# EasyEDA schematic TOUG.json
TITLE: Sheet_1; REV: 1.0; Date: 2024-01-13; Sheet: 1/1; Drawn By: djtef; Company: Your Company
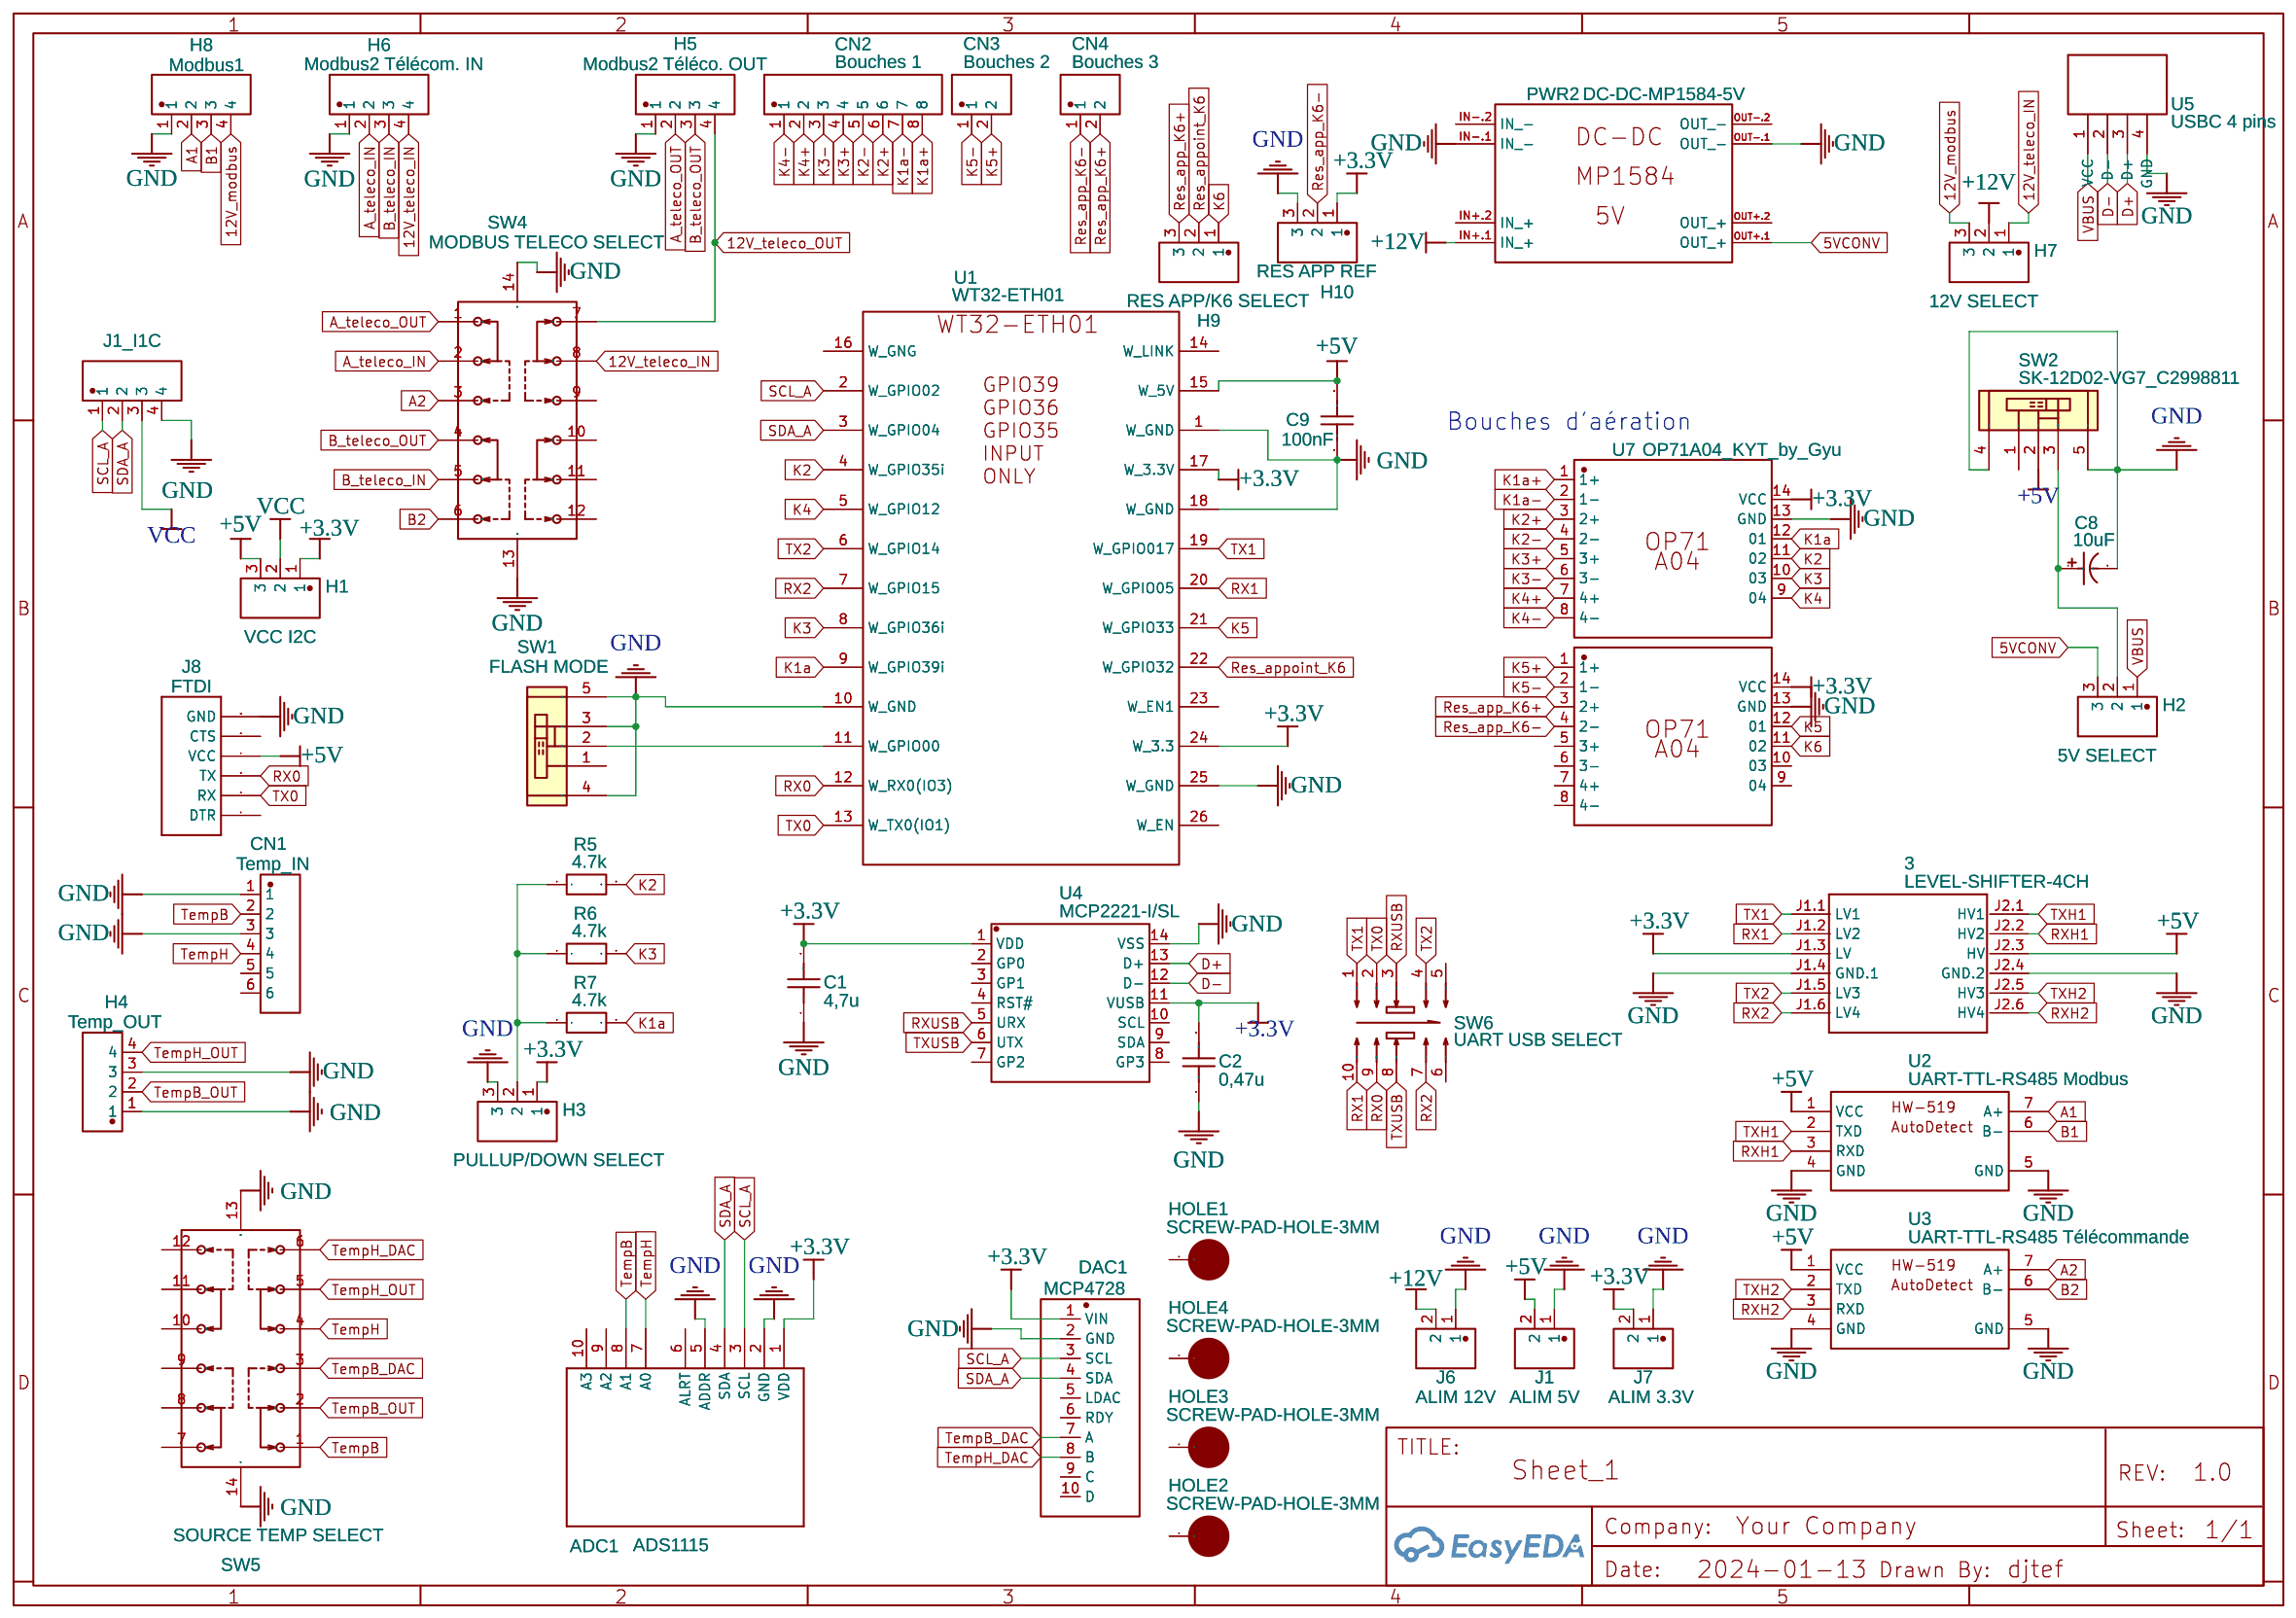
[diagram p0: schematic sheet]

## Parts
3  LEVEL-SHIFTER-4CH  [LEVEL-SHIFTER-4CH]
ADC1  ADS1115  [ADC-4CH-ADS1115]
C1  4,7u  [RAD-0.1]
C2  0,47u  [RAD-0.1]
C8  10uF  [CAP-TH_BD5.0-P2.00-D0.8-FD]
C9  100nF  [CAP-TH_L7.2-W2.5-P5.00-D0.5]
CN1  Temp_IN  [CONN-TH_5P-P2.50_S06B-XASK-1-LF-SN]
CN2  Bouches 1  [CONN-TH_8P-P2.54_KF2EDGR-2.54-8P]
CN3  Bouches 2  [CONN-TH_P2.54_KF2EDGR-2.54-2P]
CN4  Bouches 3  [CONN-TH_P2.54_KF2EDGR-2.54-2P]
DAC1  MCP4728  [MCP4728]
H1  VCC I2C  [HDR-TH_3P-P2.54-V-M]
H2  5V SELECT  [HDR-TH_3P-P2.54-V-M]
H3  PULLUP/DOWN SELECT  [HDR-TH_3P-P2.54-V-M]
H4  Temp_OUT  [HDR-TH_4P-P2.50-V-F-1]
H5  Modbus2 Téléco. OUT  [CONN-TH_S04B-XASK-1-LF-SN]
H6  Modbus2 Télécom. IN  [HDR-TH_4P-P2.50-V-F-1]
H7  12V SELECT  [HDR-TH_3P-P2.54-V-M]
H8  Modbus1  [HDR-TH_4P-P2.50-V-F-1]
H9  RES APP/K6 SELECT  [HDR-TH_3P-P2.54-V-M]
H10  RES APP REF  [HDR-TH_3P-P2.54-V-M]
HOLE1  SCREW-PAD-HOLE-3MM  [PKG-SCREW-MOUNTING-HOLE-3MM]
HOLE2  SCREW-PAD-HOLE-3MM  [PKG-SCREW-MOUNTING-HOLE-3MM]
HOLE3  SCREW-PAD-HOLE-3MM  [PKG-SCREW-MOUNTING-HOLE-3MM]
HOLE4  SCREW-PAD-HOLE-3MM  [PKG-SCREW-MOUNTING-HOLE-3MM]
J1  ALIM 5V  [CONN-TH_2P-P5.08_KF2EDGR-5.08-2P]
J1_I1C  I2C  [HDR-TH_4P-P2.50-V-F-1]
J6  ALIM 12V  [CONN-TH_P5.00_KF301-5.0-2P]
J7  ALIM 3.3V  [CONN-TH_2P-P5.08_KF2EDGR-5.08-2P]
J8  FTDI  [FTDI]
PWR2  DC-DC-MP1584-5V  [DC-DC-STEP-DOWN-MP1584]
R5  4.7k  [RES-TH_BD2.7-L6.2-P10.20-D0.4]
R6  4.7k  [RES-TH_BD2.7-L6.2-P10.20-D0.4]
R7  4.7k  [RES-TH_BD2.7-L6.2-P10.20-D0.4]
SW1  FLASH MODE  [SW-TH_DEALON_SK-12D02-VG7]
SW2  SK-12D02-VG7_C2998811  [SW-TH_DEALON_SK-12D02-VG7]
SW4  MODBUS TELECO SELECT  [SW-TH_KH-SS42D02-G3]
SW5  SOURCE TEMP SELECT  [SW-TH_KH-SS42D02-G3]
SW6  UART USB SELECT  [SW-TH_10P-L29.8-W9.2-P4.00_SS-24H03-G070]
U1  WT32-ETH01  [WT32-ETH01]
U2  UART-TTL-RS485 Modbus  [UART-TTL-RS485. V2]
U3  UART-TTL-RS485 Télécommande  [UART-TTL-RS485. V2]
U4  MCP2221-I/SL  [SOIC-14_L8.7-W3.9-P1.27-LS6.0-BL]
U5  USBC 4 pins  [USB_C 4 PIN]
U7  OP71A04_KYT_by_Gyu  [OP71]
U14  OP71A04_KYT_by_Gyu  [OP71]

## Library data of the parts
3 = LEVEL-SHIFTER-4CH: Contributor: vivianmascarinhas
ADC1 = ADC-4CH-ADS1115: Contributor: David de la Torre
C1 C2 = C_RAD-0.1_US: Contributor: LCEDA_Lib
C8 = electrolytic capacitor 10UF 50V high frequency: Supplier: LCSC; Manufacturer: CX(承兴); Manufacturer Part: GR106M050D11RR0VK2FP0; Supplier Part: C78759; JLCPCB Part Class: Extended Part
C9 = PE104J2A0501: Contributor: LCSC; Supplier: LCSC; Supplier Part: C390170; Manufacturer: KYET(科雅); JLCPCB Part Class: Extended Part
CN1 = S06B-XASK-1(LF)(SN): Contributor: LCSC; Supplier: LCSC; Supplier Part: C263755; Manufacturer: JST; JLCPCB Part Class: Extended Part
CN2 = KF2EDGR-2.54-8P: Contributor: LCSC; Supplier: LCSC; Supplier Part: C577600; Manufacturer: KEFA(科发); JLCPCB Part Class: Extended Part
CN3 CN4 = KF2EDGR-2.54-2P: Contributor: LCSC; Supplier: LCSC; Supplier Part: C577594; Manufacturer: KEFA(科发); JLCPCB Part Class: Extended Part
DAC1 = GY-MCP4728: Manufacturer: Aliexpress; Supplier: Aliexpress; link: https://www.aliexpress.com/item/1005003649040920.html?spm=a2g0o.order_list.0.0.4ef63696hAxzZi&gatewayAdapt=glo2ita; Contributor: Kristoffer Olström
H1-H3 H7 H9 H10 = DZ254R-11-03-63: Contributor: LCSC; Supplier: LCSC; Supplier Part: C2935909; Manufacturer: DEALON(德艺隆); JLCPCB Part Class: Extended Part
H4 H6 H8 J1_I1C = XH-2.54-4P: Contributor: LCSC; Supplier: LCSC; Supplier Part: C18185674; Manufacturer: SHOU HAN(首韩); Manufacturer Part: 2.54-4P WZDK; JLCPCB Part Class: Extended Part
H5 = XH-2.54-4P: Contributor: LCSC; Supplier: LCSC; Supplier Part: C22382738; Manufacturer: DLL; Manufacturer Part: DL25018-4AWD-S; JLCPCB Part Class: Extended Part
HOLE1-HOLE4 = SCREW-PAD-HOLE-3MM: THT 3MM SCREW MOUNTING HOLE; Contributor: Prof. Ing. F. Scordino
J1 J7 = KF2EDGR-5.08-2P: Contributor: LCSC; Supplier: LCSC; Supplier Part: C441204; Manufacturer: KEFA(科发); JLCPCB Part Class: Extended Part
J6 = KF301-5.0-2P: Contributor: LCSC; Supplier: LCSC; Supplier Part: C474881; Manufacturer: KEFA(科发); JLCPCB Part Class: Extended Part
J8 = FTDI HEADERX6: Contributor: cpu76239
PWR2 = DC-DC-MP1584-5V: Contributor: karel.slavicek
R5-R7 = R_AXIAL-1.0_EU: Supplier Part: C2896834; Supplier: LCSC; Contributor: LCEDA_Lib; Manufacturer Part: CR1/4W-4K7±5%-ST52; Manufacturer: VO(翔胜)
SW1 SW2 = SK-12D02-VG7_C2998811: Contributor: lcsc; Supplier: LCSC; Supplier Part: C2998811; Manufacturer: DEALON(德艺隆); Manufacturer Part: SK-12D02-VG7; JLCPCB Part Class: Extended Part; link: https://lcsc.com/eda_search?q=C2998811&%26type=1&ref=editor
SW4 SW5 = KH-SS42D02-G3: Contributor: lcsc; Supplier: LCSC; Supplier Part: C5274503; Manufacturer: kinghelm(金航标); JLCPCB Part Class: Extended Part
SW6 = SS-24H03-G070: Contributor: LCSC; Supplier: LCSC; Supplier Part: C2876019; Manufacturer: G-Switch(品赞); JLCPCB Part Class: Extended Part
U1 = WT32-ETH01: Manufacturer: Wireless-Tag; link: http://www.wireless-tag.com/wp-content/uploads/2020/08/WT32-ETH01规格书V1.2EN（英文）.pdf; Contributor: chicoDaMan
U2 U3 = UART-TTL-RS485_HW-519: Contributor: Compesalogger
U4 = MCP2221-I/SL: Contributor: LCSC; Supplier: LCSC; Supplier Part: C184842; Manufacturer: MICROCHIP(美国微芯); JLCPCB Part Class: Extended Part
U5 = USBC 4 pins: Contributor: javier97sm
U7 U14 = OP71A04_KYT_by_Gyu: Supplier: Ali; Contributor: jirwald

## Nets
5VCONV: H2.3 PWR2.OUT+.1(OUT +)
12V_modbus: H7.3 H8.4
12V_teleco_IN: H6.4 H7.1 SW4.8
12V_teleco_OUT: H5.4 SW4.7
+3.3V: 3.J1.3(LV) ADC1.1(VDD) C1.2 C2.2 DAC1.1(VIN) H1.1 H3.1 H10.1 J7.2 U1.17(W_3.3V) U1.24(W_3.3) U4.1(VDD) U4.11(VUSB) U7.14(VCC) U14.14(VCC)
+5V: 3.J2.3(HV) C9.2 H1.3 J1.2 J8.4(VCC) SW2.2 U1.15(W_5V) U2.1(VCC) U3.1(VCC)
+12V: H7.2 J6.2 PWR2.IN+.1(IN +)
GND: 3.J1.4(GND.1) 3.J2.4(GND.2) ADC1.2(GND) ADC1.5(ADDR) C1.1 C2.1 C8.2 C9.1 CN1.1 CN1.3 DAC1.2(GND) H3.3 H4.1 H4.3 H5.1 H6.1 H8.1 H10.3 J1.1 J1_I1C.4 J6.1 J7.1 J8.6(GND) PWR2.IN-.1(IN -) PWR2.OUT-.1(OUT -) SW1.3 SW1.4 SW1.5 SW2.4 SW2.5 SW4.13 SW4.14 SW5.13 SW5.14 U1.1(W_GND) U1.10(W_GND) U1.18(W_GND) U1.25(W_GND) U2.4(GND) U2.5(GND) U3.4(GND) U3.5(GND) U4.14(VSS) U5.4(GND) U7.13(GND) U14.13(GND)
VBUS: H2.1 U5.1(VCC)
VCC: H1.2 J1_I1C.3
A1: H8.2 U2.7(A+)
A2: SW4.3 U3.7(A+)
A_teleco_IN: H6.2 SW4.2
A_teleco_OUT: H5.2 SW4.1
B1: H8.3 U2.6(B-)
B2: SW4.6 U3.6(B-)
B_teleco_IN: H6.3 SW4.5
B_teleco_OUT: H5.3 SW4.4
D+: U4.13(D+) U5.3(D+)
D-: U4.12(D-) U5.2(D-)
K1a: R7.2 U1.9(W_GPIO39i) U7.12(01)
K1a+: CN2.8 U7.1(1+)
K1a-: CN2.7 U7.2(1-)
K2: R5.2 U1.4(W_GPIO35i) U7.11(02)
K2+: CN2.6 U7.3(2+)
K2-: CN2.5 U7.4(2-)
K3: R6.2 U1.8(W_GPIO36i) U7.10(03)
K3+: CN2.4 U7.5(3+)
K3-: CN2.3 U7.6(3-)
K4: U1.5(W_GPIO12) U7.9(04)
K4+: CN2.2 U7.7(4+)
K4-: CN2.1 U7.8(4-)
K5: U1.21(W_GPIO33) U14.12(01)
K5+: CN3.2 U14.1(1+)
K5-: CN3.1 U14.2(1-)
K6: H9.1 U14.11(02)
Res_app_K6+: CN4.2 H9.3 U14.3(2+)
Res_app_K6-: CN4.1 H10.2 U14.4(2-)
Res_appoint_K6: H9.2 U1.22(W_GPIO32)
RX0: J8.3(TX) SW6.9 U1.12(W_RX0(IO3))
RX1: 3.J1.2(LV2) SW6.10 U1.20(W_GPIO05)
RX2: 3.J1.6(LV4) SW6.7 U1.7(W_GPIO15)
RXH1: 3.J2.2(HV2) U2.3(RXD)
RXH2: 3.J2.6(HV4) U3.3(RXD)
RXUSB: SW6.3 U4.5(URX)
SCL_A: ADC1.3(SCL) DAC1.3(SCL) J1_I1C.1 U1.2(W_GPIO02)
SDA_A: ADC1.4(SDA) DAC1.4(SDA) J1_I1C.2 U1.3(W_GPIO04)
TempB: ADC1.8(A1) CN1.2 SW5.1
TempB_DAC: DAC1.7(A) SW5.3
TempB_OUT: H4.2 SW5.2
TempH: ADC1.7(A0) CN1.4 SW5.4
TempH_DAC: DAC1.8(B) SW5.6
TempH_OUT: H4.4 SW5.5
TX0: J8.2(RX) SW6.2 U1.13(W_TX0(IO1))
TX1: 3.J1.1(LV1) SW6.1 U1.19(W_GPIO017)
TX2: 3.J1.5(LV3) SW6.4 U1.6(W_GPIO14)
TXH1: 3.J2.1(HV1) U2.2(TXD)
TXH2: 3.J2.5(HV3) U3.2(TXD)
TXUSB: SW6.8 U4.6(UTX)
Net-(C8-1): C8.1 H2.2 SW2.3
Net-(H3-2): H3.2 R5.1 R6.1 R7.1
Net-(SW1-2): SW1.2 U1.11(W_GPIO00)

Not connected (* = marked no-connect by the designer): ADC1 6(ALRT) 9(A2) 10(A3); CN1 5 6; DAC1 5(LDAC) 6(RDY) 9(C) 10(D); HOLE1 1; HOLE2 1; HOLE3 1; HOLE4 1; J8 1(DTR) 5(CTS); PWR2 IN+.2(IN +) IN-.2(IN -) OUT+.2(OUT +) OUT-.2(OUT -); SW1 1; SW2 1; SW4 9 10 11 12; SW5 7 8 9 10 11 12; SW6 5 6; U1 14(W_LINK) 16(W_GNG) 23(W_EN1) 26(W_EN); U4 2(GP0) 3(GP1) 4(RST#) 7(GP2) 8(GP3) 9(SDA) 10(SCL); U14 5(3+) 6(3-) 7(4+) 8(4-) 9(04) 10(03)

## Notes on the sheet
- Bouches d'aération
